# Altium schematic sheet mainboard_interface.v1.2.SchDoc
size A4
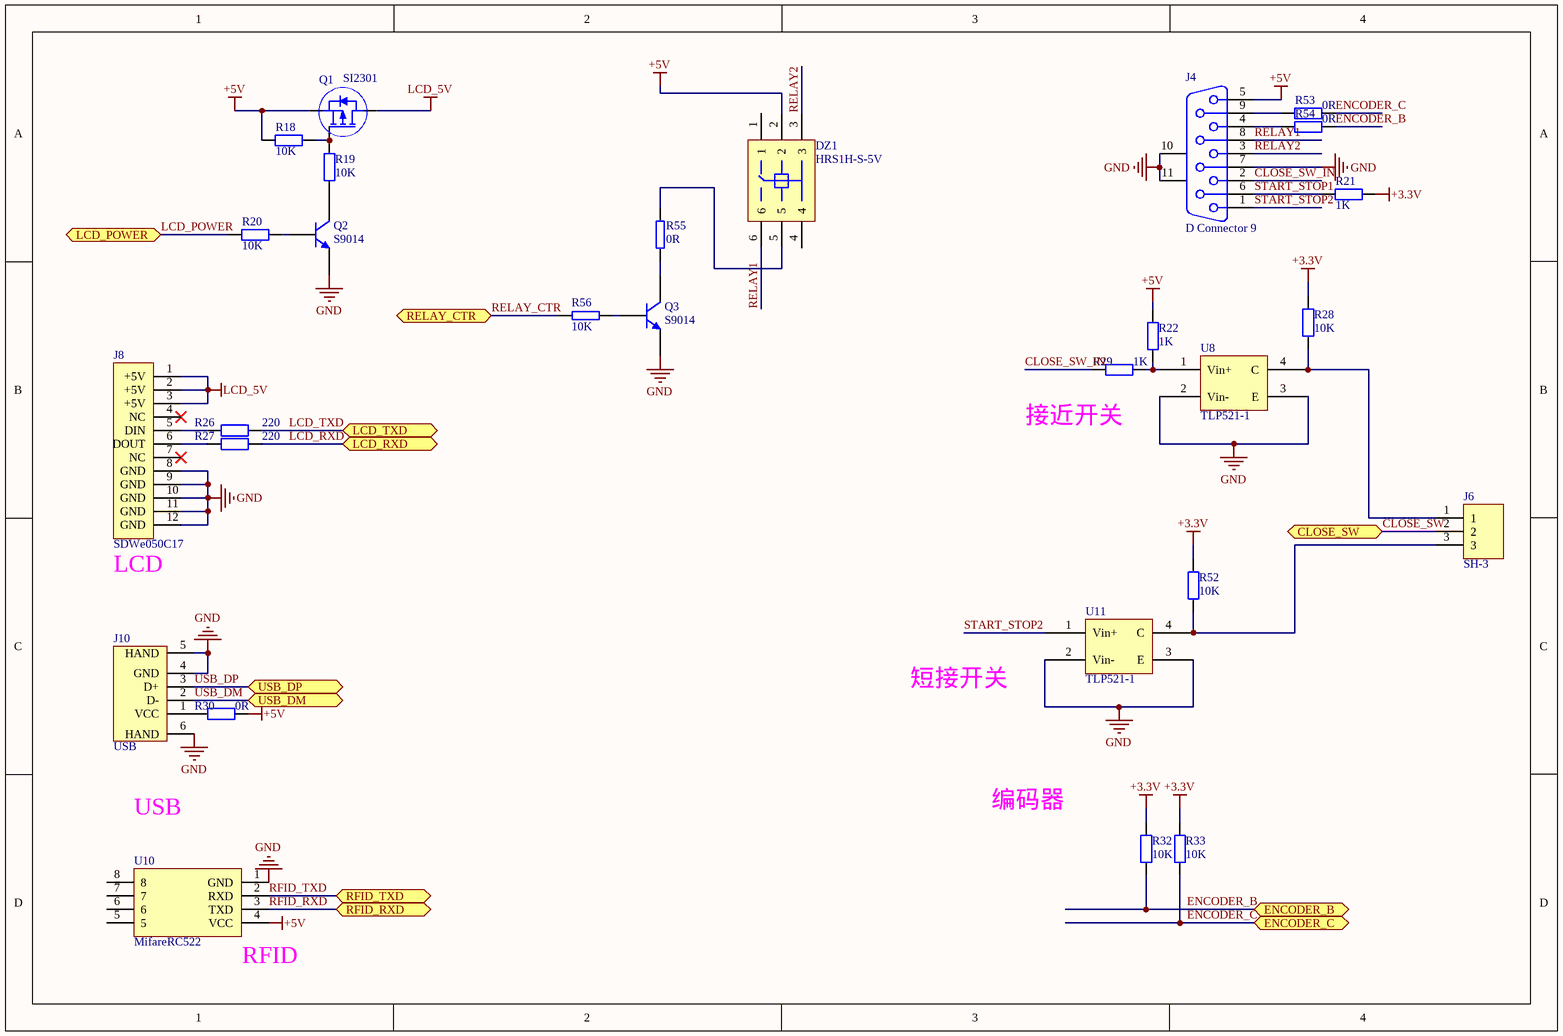
[diagram p0: mainboard_interface.v1.2.SchDoc]

## Parts
DZ1  HRS1H-S-5V
J4  D Connector 9  [DSUB1.385-2H9]
J6  SH-3  [J2.54-3]
J8  SDWe050C17  [FCC1.0-10]
J10  USB  [USB_FEMALE_A]
Q1  SI2301  [MOS-N_SOT-23]
Q2  S9014  [901X_SOT-23]
Q3  S9014  [901X_SOT-23]
R18  10K  [0805]
R19  10K  [0805]
R20  10K  [0805]
R21  1K  [0805]
R22  1K  [0805]
R26  220  [0805]
R27  220  [0805]
R28  10K  [0805]
R29  1K  [0805]
R30  0R  [0805]
R32  10K  [0805]
R33  10K  [0805]
R52  10K  [0805]
R53  0R  [0805]
R54  0R  [0805]
R55  0R  [0805]
R56  10K  [0805]
U8  TLP521-1  [TLP521-1]
U10  MifareRC522  [MifareRC522]
U11  TLP521-1  [TLP521-1]

## Ports
CLOSE_SW, ENCODER_B, ENCODER_C, LCD_POWER, LCD_RXD, LCD_TXD, RELAY_CTR, RFID_RXD, RFID_TXD, USB_DM, USB_DP

## Nets
+3.3V: R21.2 R28.1 R32.1 R33.1 R52.1
+5V: DZ1.2 J4.5 Q1.S R18.1 R22.1 R30.1 U10.4(VCC)
GND: J4.7 J4.10(MH1) J4.11(MH2) J8.8(GND) J8.9(GND) J8.10(GND) J8.11(GND) J8.12(GND) J10.4(GND) J10.5(HAND) J10.6(HAND) Q2.3(E) Q3.3(E) U8.2(Vin-) U8.3(E) U10.1(GND) U11.2(Vin-) U11.3(E)
LCD_5V: J8.1(+5V) J8.2(+5V) J8.3(+5V) Q1.D
CLOSE_SW: J6.2 ; port CLOSE_SW
CLOSE_SW_IN: J4.2 R29.2
ENCODER_B: R32.2 R54.2 ; port ENCODER_B
ENCODER_C: R33.2 R53.2 ; port ENCODER_C
LCD_POWER: R20.1 ; port LCD_POWER
LCD_RXD: R27.2 ; port LCD_RXD
LCD_TXD: R26.2 ; port LCD_TXD
RELAY1: DZ1.6 J4.8
RELAY2: DZ1.3 J4.3
RELAY_CTR: R56.2 ; port RELAY_CTR
RFID_RXD: U10.3(TXD) ; port RFID_RXD
RFID_TXD: U10.2(RXD) ; port RFID_TXD
START_STOP1: J4.6 R21.1
START_STOP2: J4.1 U11.1(Vin+)
USB_DM: J10.2(D-) ; port USB_DM
USB_DP: J10.3(D+) ; port USB_DP
NetDZ1_5: DZ1.5 R55.2
NetJ4_4: J4.4 R54.1
NetJ4_9: J4.9 R53.1
NetJ6_1: J6.1 R28.2 U8.4(C)
NetJ6_3: J6.3 R52.2 U11.4(C)
NetJ8_5: J8.5(DIN) R26.1
NetJ8_6: J8.6(DOUT) R27.1
NetJ10_1: J10.1(VCC) R30.2
NetQ1_G: Q1.G R18.2 R19.2
NetQ2_1: Q2.1(C) R19.1
NetQ2_2: Q2.2(B) R20.2
NetQ3_1: Q3.1(C) R55.1
NetQ3_2: Q3.2(B) R56.1
NetR22_2: R22.2 R29.1 U8.1(Vin+)

Not connected (* = marked no-connect by the designer): DZ1 1 4; J8 4(NC)* 7(NC)*; U10 5 6 7 8

## Notes on the sheet
- (near R29) 接近开关
- (near J8) LCD
- 短接开关
- USB
- 编码器
- (near U10) RFID

## Library data of the parts
J4 = D Connector 9: Receptacle Assembly, 9 Position, Right Angle; PackageDocument: O; Positions: 9; Published: 15-Jun-2001; LatestRevisionDate: 17-Jul-2002; LatestRevisionNote: Re-released for DXP Platform.; DatasheetDocument: 1-Sep-1999; PackageReference: 788750; Publisher: Altium Limited; Orientation: Right Angle; Gender: Receptacle
J8 = SH-12
Q1 = MOS-P_SOT-23
Q2 Q3 = NPN
R18-R20 R26-R28 R30 R32 R33 R52-R54 = Res2: Resistor; Value: 1K; Published: 8-Jun-2000; LatestRevisionDate: 17-Jul-2002; LatestRevisionNote: Re-released for DXP Platform.; PackageReference: AXIAL-0.4; Publisher: Altium Limited
R21 R22 R29 = Res2: Resistor; Published: 8-Jun-2000; LatestRevisionDate: 17-Jul-2002; LatestRevisionNote: Re-released for DXP Platform.; PackageReference: AXIAL-0.4; Publisher: Altium Limited; Value: 1K
R55 R56 = RES: 电阻